# Altium schematic sheet MR26_GSS_2.SchDoc
size 330 x 296 mm; Origin: Eagle; OriginPath: C:\Users\David Nguyen\Downloads\eagle\eagle\MR26_GSS.sch; OriginSheet: 3; OriginDescription: 04 MCU STM32G474RET6
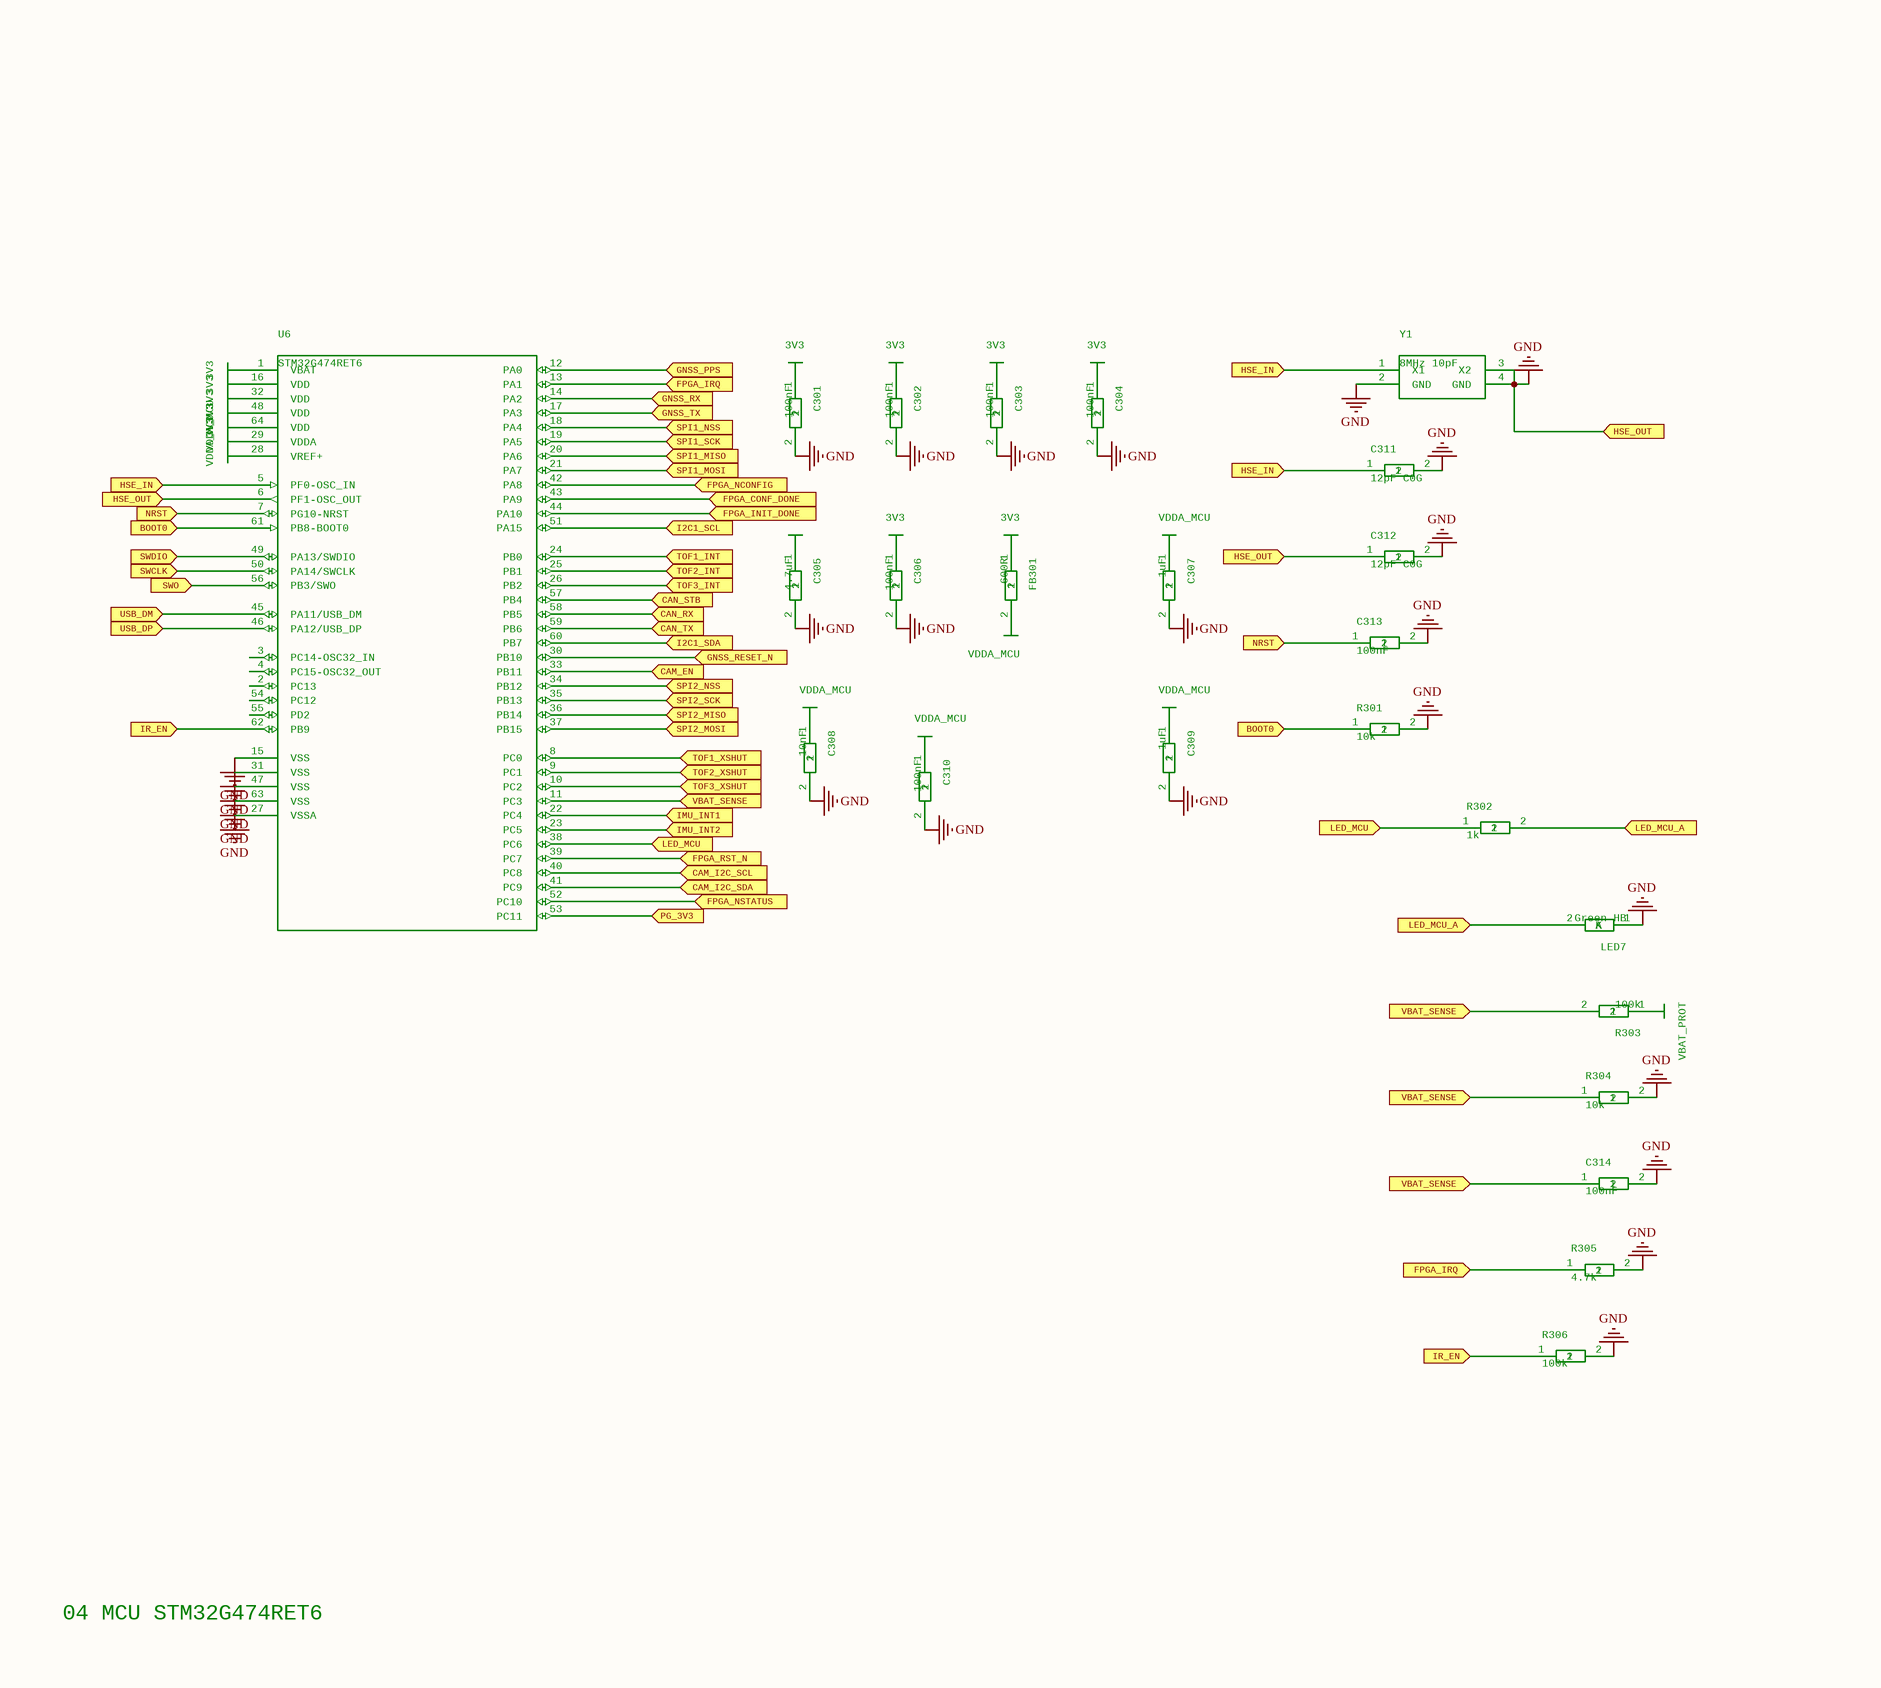
[diagram p0: MR26_GSS_2.SchDoc]

## Parts
C301  100nF  [C_0402]
C302  100nF  [C_0402]
C303  100nF  [C_0402]
C304  100nF  [C_0402]
C305  4.7uF  [C_0603]
C306  100nF  [C_0402]
C307  1uF  [C_0402]
C308  10nF  [C_0402]
C309  1uF  [C_0402]
C310  100nF  [C_0402]
C311  12pF C0G  [C_0402]
C312  12pF C0G  [C_0402]
C313  100nF  [C_0402]
C314  100nF  [C_0402]
FB301  600R  [L_0402]
LED7  Green HB  [LED_0603]
PWR0143  3V3
PWR0144  3V3
PWR0145  3V3
PWR0146  3V3
PWR0147  3V3
PWR0148  VDDA_MCU
PWR0149  VDDA_MCU
PWR0155  3V3
PWR0157  3V3
PWR0159  3V3
PWR0161  3V3
PWR0163  3V3
PWR0165  3V3
PWR0167  3V3
PWR0168  VDDA_MCU
PWR0169  VDDA_MCU
PWR0171  VDDA_MCU
PWR0173  VDDA_MCU
PWR0175  VDDA_MCU
PWR0184  VBAT_PROT
R301  10k  [R_0402]
R302  1k  [R_0402]
R303  100k  [R_0402]
R304  10k  [R_0402]
R305  4.7k  [R_0402]
R306  100k  [R_0402]
U6  STM32G474RET6  [LQFP-64_10x10]
Y1  8MHz 10pF  [Crystal_3225_4pad]

## Ports
BOOT0 (in), CAM_EN (in), CAM_I2C_SCL (in), CAM_I2C_SDA (in), CAN_RX (in), CAN_STB (in), CAN_TX (in), FPGA_CONF_DONE (in), FPGA_INIT_DONE (in), FPGA_IRQ (in), FPGA_NCONFIG (in), FPGA_NSTATUS (in), FPGA_RST_N (in), GNSS_PPS (in), GNSS_RESET_N (in), GNSS_RX (in), GNSS_TX (in), HSE_IN (in), HSE_OUT (in), I2C1_SCL (in), I2C1_SDA (in), IMU_INT1 (in), IMU_INT2 (in), IR_EN (in), LED_MCU (in), LED_MCU_A (in), NRST (in), PG_3V3 (in), SPI1_MISO (in), SPI1_MOSI (in), SPI1_NSS (in), SPI1_SCK (in), SPI2_MISO (in), SPI2_MOSI (in), SPI2_NSS (in), SPI2_SCK (in), SWCLK (in), SWDIO (in), SWO (in), TOF1_INT (in), TOF1_XSHUT (in), TOF2_INT (in), TOF2_XSHUT (in), TOF3_INT (in), TOF3_XSHUT (in), USB_DM (in), USB_DP (in), VBAT_SENSE (in)

## Nets
GND: C301.2 C302.2 C303.2 C304.2 C305.2 C306.2 C307.2 C308.2 C309.2 C310.2 C311.2 C312.1 C312.2 C313.2 C314.2 LED7.1(K) R301.2 R304.2 R305.2 R306.2 U6.6(PF1-OSC_OUT) U6.15(VSS) U6.27(VSSA) U6.31(VSS) U6.47(VSS) U6.63(VSS) Y1.2(GND) Y1.3(X2) Y1.4(GND) ; port HSE_OUT
BOOT0: R301.1 U6.61(PB8-BOOT0) ; port BOOT0
CAM_EN: U6.33(PB11) ; port CAM_EN
CAM_I2C_SCL: U6.40(PC8) ; port CAM_I2C_SCL
CAM_I2C_SDA: U6.41(PC9) ; port CAM_I2C_SDA
CAN_RX: U6.58(PB5) ; port CAN_RX
CAN_STB: U6.57(PB4) ; port CAN_STB
CAN_TX: U6.59(PB6) ; port CAN_TX
FPGA_CONF_DONE: U6.43(PA9) ; port FPGA_CONF_DONE
FPGA_INIT_DONE: U6.44(PA10) ; port FPGA_INIT_DONE
FPGA_IRQ: R305.1 U6.13(PA1) ; port FPGA_IRQ
FPGA_NCONFIG: U6.42(PA8) ; port FPGA_NCONFIG
FPGA_NSTATUS: U6.52(PC10) ; port FPGA_NSTATUS
FPGA_RST_N: U6.39(PC7) ; port FPGA_RST_N
GNSS_PPS: U6.12(PA0) ; port GNSS_PPS
GNSS_RESET_N: U6.30(PB10) ; port GNSS_RESET_N
GNSS_RX: U6.14(PA2) ; port GNSS_RX
GNSS_TX: U6.17(PA3) ; port GNSS_TX
HSE_IN: C311.1 U6.5(PF0-OSC_IN) Y1.1(X1) ; port HSE_IN
I2C1_SCL: U6.51(PA15) ; port I2C1_SCL
I2C1_SDA: U6.60(PB7) ; port I2C1_SDA
IMU_INT1: U6.22(PC4) ; port IMU_INT1
IMU_INT2: U6.23(PC5) ; port IMU_INT2
IR_EN: R306.1 U6.62(PB9) ; port IR_EN
LED_MCU: R302.1 U6.38(PC6) ; port LED_MCU
LED_MCU_A: LED7.2(A) R302.2 ; port LED_MCU_A
NRST: C313.1 U6.7(PG10-NRST) ; port NRST
PG_3V3: U6.53(PC11) ; port PG_3V3
SPI1_MISO: U6.20(PA6) ; port SPI1_MISO
SPI1_MOSI: U6.21(PA7) ; port SPI1_MOSI
SPI1_NSS: U6.18(PA4) ; port SPI1_NSS
SPI1_SCK: U6.19(PA5) ; port SPI1_SCK
SPI2_MISO: U6.36(PB14) ; port SPI2_MISO
SPI2_MOSI: U6.37(PB15) ; port SPI2_MOSI
SPI2_NSS: U6.34(PB12) ; port SPI2_NSS
SPI2_SCK: U6.35(PB13) ; port SPI2_SCK
SWCLK: U6.50(PA14/SWCLK) ; port SWCLK
SWDIO: U6.49(PA13/SWDIO) ; port SWDIO
SWO: U6.56(PB3/SWO) ; port SWO
TOF1_INT: U6.24(PB0) ; port TOF1_INT
TOF1_XSHUT: U6.8(PC0) ; port TOF1_XSHUT
TOF2_INT: U6.25(PB1) ; port TOF2_INT
TOF2_XSHUT: U6.9(PC1) ; port TOF2_XSHUT
TOF3_INT: U6.26(PB2) ; port TOF3_INT
TOF3_XSHUT: U6.10(PC2) ; port TOF3_XSHUT
USB_DM: U6.45(PA11/USB_DM) ; port USB_DM
USB_DP: U6.46(PA12/USB_DP) ; port USB_DP
VBAT_SENSE: C314.1 R303.2 R304.1 U6.11(PC3) ; port VBAT_SENSE
NetC301_1: C301.1 PWR0155.?1(3V3)
NetC302_1: C302.1 PWR0157.?1(3V3)
NetC303_1: C303.1 PWR0159.?1(3V3)
NetC304_1: C304.1 PWR0161.?1(3V3)
NetC305_1: C305.1 PWR0163.?1(3V3)
NetC306_1: C306.1 PWR0165.?1(3V3)
NetC307_1: C307.1 PWR0169.?1(VDDA_MCU)
NetC308_1: C308.1 PWR0171.?1(VDDA_MCU)
NetC309_1: C309.1 PWR0173.?1(VDDA_MCU)
NetC310_1: C310.1 PWR0175.?1(VDDA_MCU)
NetFB301_1: FB301.1 PWR0167.?1(3V3)
NetFB301_2: FB301.2 PWR0168.?1(VDDA_MCU)
NetPWR0143_?1: PWR0143.?1(3V3) U6.1(VBAT)
NetPWR0144_?1: PWR0144.?1(3V3) U6.16(VDD)
NetPWR0145_?1: PWR0145.?1(3V3) U6.32(VDD)
NetPWR0146_?1: PWR0146.?1(3V3) U6.48(VDD)
NetPWR0147_?1: PWR0147.?1(3V3) U6.64(VDD)
NetPWR0148_?1: PWR0148.?1(VDDA_MCU) U6.29(VDDA)
NetPWR0149_?1: PWR0149.?1(VDDA_MCU) U6.28(VREF+)
NetPWR0184_?1: PWR0184.?1(VBAT_PROT) R303.1

Not connected (* = marked no-connect by the designer): U6 2(PC13) 3(PC14-OSC32_IN) 4(PC15-OSC32_OUT) 54(PC12) 55(PD2)

## Notes on the sheet
- 04 MCU STM32G474RET6

## Library data of the parts
C301-C304 C306 C310 C313 C314 = CAPC_0402: MPN: CAP 100nF 0402; GateName_1: G$1; SymbolName_1: CAP; DeviceName: C_0402; LibraryName: MR26; DeviceSetName: CAP
C305 = CAPC_0603: MPN: CAP 4.7uF 0603; GateName_1: G$1; SymbolName_1: CAP; DeviceName: C_0603; LibraryName: MR26; DeviceSetName: CAP
C307 C309 = CAPC_0402: MPN: CAP 1uF 0402; GateName_1: G$1; SymbolName_1: CAP; DeviceName: C_0402; LibraryName: MR26; DeviceSetName: CAP
C308 = CAPC_0402: MPN: CAP 10nF 0402; GateName_1: G$1; SymbolName_1: CAP; DeviceName: C_0402; LibraryName: MR26; DeviceSetName: CAP
C311 C312 = CAPC_0402: MPN: CAP 12pF C0G 0402; GateName_1: G$1; SymbolName_1: CAP; DeviceName: C_0402; LibraryName: MR26; DeviceSetName: CAP
FB301 = FERRITEL_0402: MPN: Murata BLM15AG601SN1D; GateName_1: G$1; SymbolName_1: FERRITE; DeviceName: L_0402; LibraryName: MR26; DeviceSetName: FERRITE
LED7 = LEDLED_0603: MPN: Wurth 150060GS75000; GateName_1: G$1; SymbolName_1: LED; DeviceName: LED_0603; LibraryName: MR26; DeviceSetName: LED
PWR0143 PWR0144 PWR0145 PWR0146 PWR0147 PWR0155 PWR0157 PWR0159 PWR0161 PWR0163 PWR0165 PWR0167 = PWR_3V3: GateName_1: G$1; SymbolName_1: PWR_3V3; LibraryName: MR26; DeviceSetName: PWR_3V3
PWR0148 PWR0149 PWR0168 PWR0169 PWR0171 PWR0173 PWR0175 = PWR_VDDA_MCU: GateName_1: G$1; SymbolName_1: PWR_VDDA_MCU; LibraryName: MR26; DeviceSetName: PWR_VDDA_MCU
PWR0184 = PWR_VBAT_PROT: GateName_1: G$1; SymbolName_1: PWR_VBAT_PROT; LibraryName: MR26; DeviceSetName: PWR_VBAT_PROT
R301 R304 = RESR_0402: MPN: RES 10k 0402; GateName_1: G$1; SymbolName_1: RES; DeviceName: R_0402; LibraryName: MR26; DeviceSetName: RES
R302 = RESR_0402: MPN: RES 1k 0402; GateName_1: G$1; SymbolName_1: RES; DeviceName: R_0402; LibraryName: MR26; DeviceSetName: RES
R303 R306 = RESR_0402: MPN: RES 100k 0402; GateName_1: G$1; SymbolName_1: RES; DeviceName: R_0402; LibraryName: MR26; DeviceSetName: RES
R305 = RESR_0402: MPN: RES 4.7k 0402; GateName_1: G$1; SymbolName_1: RES; DeviceName: R_0402; LibraryName: MR26; DeviceSetName: RES
U6 = STM32G474RET6LQFP-64_10x10: GateName_1: G$1; SymbolName_1: STM32G474RET6; DeviceName: LQFP-64_10x10; LibraryName: MR26; DeviceSetName: STM32G474RET6; MPN: STM32G474RET6
Y1 = XTAL_4PADCrystal_3225_4pad: MPN: Abracon ABM8-8.000MHZ-10-D1G-T; GateName_1: G$1; SymbolName_1: XTAL_4PAD; DeviceName: Crystal_3225_4pad; LibraryName: MR26; DeviceSetName: XTAL_4PAD